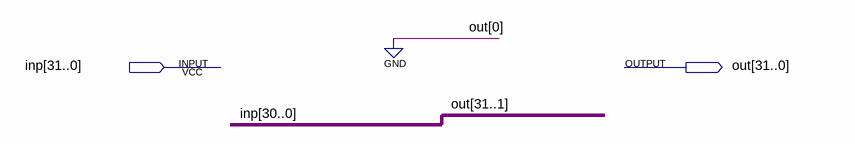
[diagram p0: schematic sheet]
// Quartus schematic one_bit_left_shifter.bdf as structural Verilog: 0 symbols, 2 pins
module one_bit_left_shifter (
  input  [31:0] inp,
  output [31:0] out
);


  assign out[0] = 1'b0;
endmodule
